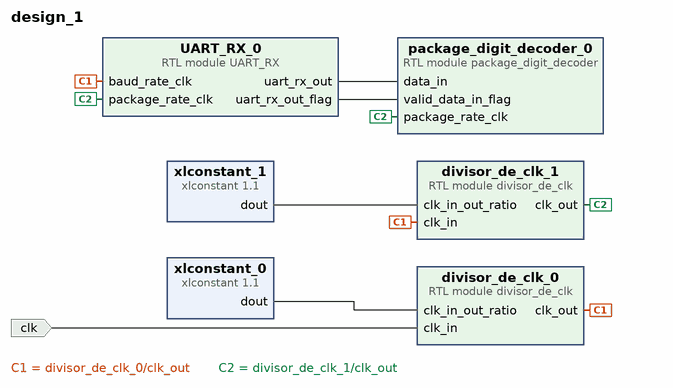
[diagram p0: block diagram of the top level]
# Vivado block design design_1, xc7a35tcpg236-1, Vivado 2020.1
create_bd_design design_1

create_bd_port -dir I clk

create_bd_cell -type module -reference divisor_de_clk divisor_de_clk_0
create_bd_cell -type ip -vlnv xilinx.com:ip:xlconstant:1.1 xlconstant_0
set_property -dict {CONFIG.CONST_VAL 10000 CONFIG.CONST_WIDTH 14} [get_bd_cells xlconstant_0]
create_bd_cell -type module -reference divisor_de_clk divisor_de_clk_1
create_bd_cell -type ip -vlnv xilinx.com:ip:xlconstant:1.1 xlconstant_1
set_property -dict {CONFIG.CONST_VAL 11 CONFIG.CONST_WIDTH 14} [get_bd_cells xlconstant_1]
create_bd_cell -type module -reference package_digit_decoder package_digit_decoder_0
create_bd_cell -type module -reference UART_RX UART_RX_0

# ---- connections ----

connect_bd_net [get_bd_pins xlconstant_0/dout] [get_bd_pins divisor_de_clk_0/clk_in_out_ratio]
connect_bd_net [get_bd_ports clk] [get_bd_pins divisor_de_clk_0/clk_in]
connect_bd_net [get_bd_pins divisor_de_clk_0/clk_out] [get_bd_pins divisor_de_clk_1/clk_in] [get_bd_pins UART_RX_0/baud_rate_clk]
connect_bd_net [get_bd_pins xlconstant_1/dout] [get_bd_pins divisor_de_clk_1/clk_in_out_ratio]
connect_bd_net [get_bd_pins divisor_de_clk_1/clk_out] [get_bd_pins package_digit_decoder_0/package_rate_clk] [get_bd_pins UART_RX_0/package_rate_clk]
connect_bd_net [get_bd_pins UART_RX_0/uart_rx_out] [get_bd_pins package_digit_decoder_0/data_in]
connect_bd_net [get_bd_pins UART_RX_0/uart_rx_out_flag] [get_bd_pins package_digit_decoder_0/valid_data_in_flag]

validate_bd_design
save_bd_design
